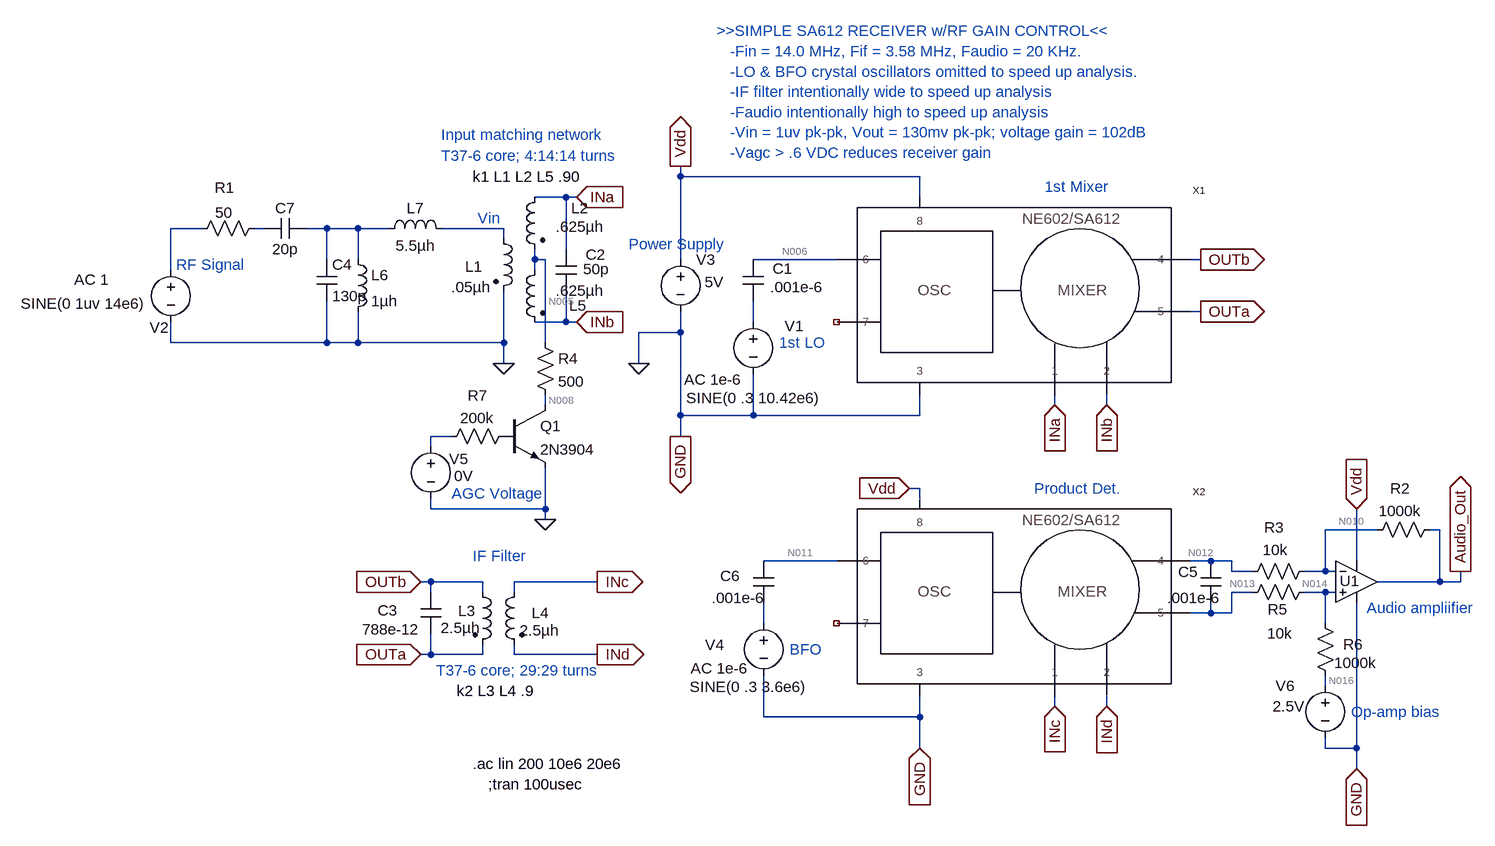
[diagram p0: schematic NE602 Rx.asc]
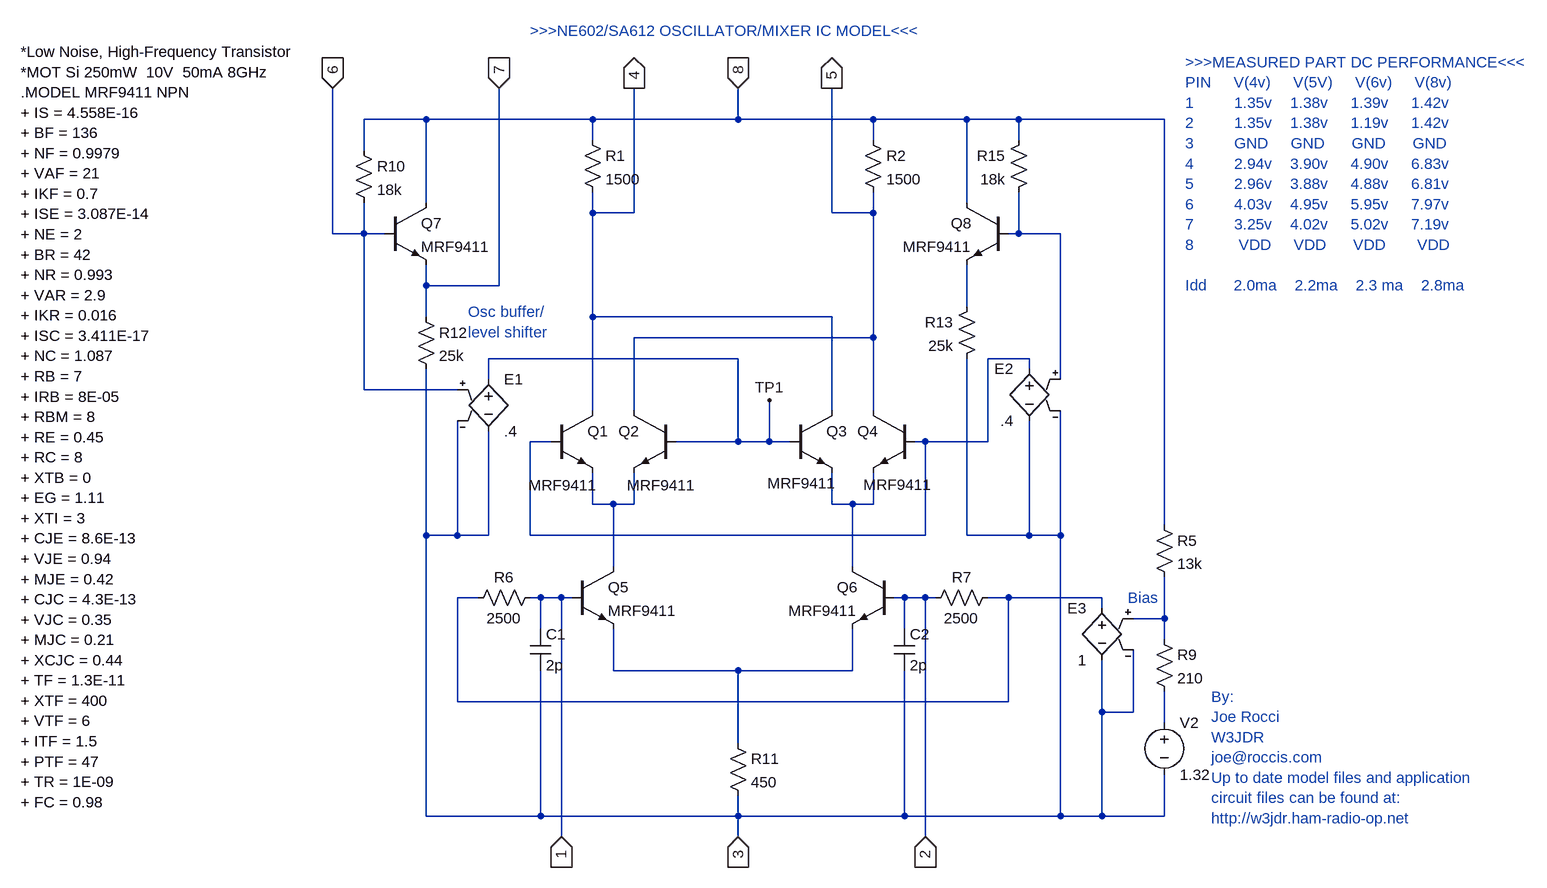
[diagram p1: sub-circuit sa612.asc]
NE602 Rx.asc, the LTspice schematic file:
Version 4
SHEET 1 2600 1360
WIRE -176 -352 -176 -368
WIRE 192 -352 -176 -352
WIRE -352 -320 -400 -320
WIRE -336 -320 -352 -320
WIRE 192 -320 192 -352
WIRE -912 -272 -960 -272
WIRE -816 -272 -832 -272
WIRE -720 -272 -752 -272
WIRE -672 -272 -720 -272
WIRE -624 -272 -672 -272
WIRE -448 -272 -544 -272
WIRE -448 -256 -448 -272
WIRE -352 -240 -352 -320
WIRE -720 -224 -720 -272
WIRE -672 -224 -672 -272
WIRE -400 -224 -400 -240
WIRE -384 -224 -400 -224
WIRE -176 -224 -176 -352
WIRE 64 -224 -64 -224
WIRE 624 -224 608 -224
WIRE -960 -208 -960 -272
WIRE -400 -208 -400 -224
WIRE 624 -144 608 -144
WIRE -352 -128 -352 -176
WIRE -352 -128 -400 -128
WIRE -336 -128 -352 -128
WIRE -64 -128 -64 -160
WIRE -176 -112 -176 -144
WIRE -176 -112 -240 -112
WIRE -960 -96 -960 -128
WIRE -720 -96 -720 -160
WIRE -720 -96 -960 -96
WIRE -672 -96 -672 -144
WIRE -672 -96 -720 -96
WIRE -448 -96 -448 -176
WIRE -448 -96 -672 -96
WIRE -384 -96 -384 -224
WIRE -448 -64 -448 -96
WIRE -240 -64 -240 -112
WIRE -384 0 -384 -16
WIRE 400 0 400 -16
WIRE 480 0 480 -16
WIRE -176 16 -176 -112
WIRE -64 16 -64 -48
WIRE -64 16 -176 16
WIRE 192 16 192 -16
WIRE 192 16 -64 16
WIRE -528 48 -560 48
WIRE -176 48 -176 16
WIRE -560 64 -560 48
WIRE 192 128 176 128
WIRE 192 144 192 128
WIRE -560 160 -560 144
WIRE -384 160 -384 96
WIRE -384 160 -560 160
WIRE -384 176 -384 160
WIRE 896 192 816 192
WIRE 992 192 976 192
WIRE 64 240 -48 240
WIRE 640 240 608 240
WIRE 672 240 640 240
WIRE 864 240 864 160
WIRE 672 256 672 240
WIRE 704 256 672 256
WIRE 816 256 816 192
WIRE 816 256 784 256
WIRE 832 256 816 256
WIRE -560 272 -576 272
WIRE -480 272 -560 272
WIRE -304 272 -432 272
WIRE 992 272 992 192
WIRE 992 272 896 272
WIRE 1024 272 1024 256
WIRE 1024 272 992 272
WIRE -560 288 -560 272
WIRE -480 288 -480 272
WIRE -432 288 -432 272
WIRE 704 288 672 288
WIRE 816 288 784 288
WIRE 832 288 816 288
WIRE 640 320 640 304
WIRE 640 320 608 320
WIRE 672 320 672 288
WIRE 672 320 640 320
WIRE -48 336 -48 304
WIRE 816 336 816 288
WIRE -560 384 -560 352
WIRE -560 384 -576 384
WIRE -480 384 -480 368
WIRE -480 384 -560 384
WIRE -432 384 -432 368
WIRE -304 384 -432 384
WIRE 816 432 816 416
WIRE 400 464 400 448
WIRE 480 464 480 448
WIRE -48 480 -48 416
WIRE 192 480 192 448
WIRE 192 480 -48 480
WIRE 192 528 192 480
WIRE 816 528 816 512
WIRE 864 528 864 304
WIRE 864 528 816 528
WIRE 864 560 864 528
FLAG -176 -368 Vdd
IOPIN -176 -368 Out
FLAG -176 48 GND
IOPIN -176 48 Out
FLAG -240 -64 0
FLAG -576 272 OUTb
IOPIN -576 272 In
FLAG -576 384 OUTa
IOPIN -576 384 In
FLAG 624 -224 OUTb
IOPIN 624 -224 Out
FLAG 624 -144 OUTa
IOPIN 624 -144 Out
FLAG 400 0 INa
IOPIN 400 0 In
FLAG 480 0 INb
IOPIN 480 0 In
FLAG -304 272 INc
IOPIN -304 272 Out
FLAG 176 128 Vdd
IOPIN 176 128 In
FLAG 192 528 GND
IOPIN 192 528 In
FLAG 400 464 INc
IOPIN 400 464 In
FLAG 480 464 INd
IOPIN 480 464 In
FLAG -304 384 INd
IOPIN -304 384 Out
FLAG 864 160 Vdd
IOPIN 864 160 In
FLAG 864 560 GND
IOPIN 864 560 In
FLAG 1024 256 Audio_Out
IOPIN 1024 256 Out
FLAG -384 176 0
FLAG -448 -64 0
FLAG -336 -320 INa
IOPIN -336 -320 In
FLAG -336 -128 INb
IOPIN -336 -128 In
SYMBOL voltage -176 -240 R0
WINDOW 123 0 0 Left 0
WINDOW 39 0 0 Left 0
WINDOW 3 37 51 Left 0
SYMATTR Value 5V
SYMATTR InstName V3
SYMBOL ind2 -496 272 R0
WINDOW 0 -22 45 Left 0
WINDOW 3 -49 71 Left 0
SYMATTR InstName L3
SYMATTR Value 2.5µh
SYMATTR Type ind
SYMBOL ind2 -416 272 M0
WINDOW 0 -38 48 Left 0
WINDOW 3 -53 75 Left 0
SYMATTR InstName L4
SYMATTR Value 2.5µh
SYMATTR Type ind
SYMBOL cap -576 288 R0
WINDOW 3 -90 57 Left 0
WINDOW 0 -66 28 Left 0
SYMATTR Value 788e-12
SYMATTR InstName C3
SYMBOL sa612 304 -176 R0
SYMATTR InstName X1
SYMBOL voltage -64 -144 R0
WINDOW 123 -106 105 Left 0
WINDOW 39 0 0 Left 0
WINDOW 0 48 22 Left 0
WINDOW 3 -103 133 Left 0
SYMATTR Value2 AC 1e-6
SYMATTR InstName V1
SYMATTR Value SINE(0 .3 10.42e6)
SYMBOL cap -80 -224 R0
WINDOW 0 46 14 Left 0
WINDOW 3 42 42 Left 0
SYMATTR InstName C1
SYMATTR Value .001e-6
SYMBOL sa612 304 288 R0
SYMATTR InstName X2
SYMBOL voltage -48 320 R0
WINDOW 123 -112 85 Left 0
WINDOW 39 0 0 Left 0
WINDOW 0 -90 49 Left 0
WINDOW 3 -114 114 Left 0
SYMATTR Value2 AC 1e-6
SYMATTR InstName V4
SYMATTR Value SINE(0 .3 3.6e6)
SYMBOL cap -64 240 R0
WINDOW 0 -51 23 Left 0
WINDOW 3 -64 57 Left 0
SYMATTR InstName C6
SYMATTR Value .001e-6
SYMBOL Opamps\\UniversalOpamp 864 272 R0
WINDOW 0 -26 -1 Left 0
SYMATTR InstName U1
SYMBOL res 992 176 R90
WINDOW 0 -32 61 VBottom 0
WINDOW 3 -29 61 VTop 0
SYMATTR InstName R2
SYMATTR Value 1000k
SYMBOL res 800 240 R90
WINDOW 0 -36 63 VBottom 0
WINDOW 3 -33 61 VTop 0
SYMATTR InstName R3
SYMATTR Value 10k
SYMBOL res 800 272 R90
WINDOW 0 58 57 VBottom 0
WINDOW 3 64 54 VTop 0
SYMATTR InstName R5
SYMATTR Value 10k
SYMBOL res 832 432 R180
WINDOW 0 -42 64 Left 0
WINDOW 3 -64 35 Left 0
SYMATTR InstName R6
SYMATTR Value 1000k
SYMBOL voltage 816 416 R0
WINDOW 0 -76 16 Left 0
WINDOW 123 0 0 Left 0
WINDOW 39 0 0 Left 0
WINDOW 3 -81 48 Left 0
SYMATTR InstName V6
SYMATTR Value 2.5V
SYMBOL cap 624 240 R0
WINDOW 0 -34 17 Left 0
WINDOW 3 -51 57 Left 0
SYMATTR InstName C5
SYMATTR Value .001e-6
SYMBOL voltage -960 -224 R0
WINDOW 123 -149 31 Left 0
WINDOW 39 0 0 Left 0
WINDOW 0 -33 105 Left 0
WINDOW 3 -231 68 Left 0
SYMATTR Value2 AC 1
SYMATTR InstName V2
SYMATTR Value SINE(0 1uv 14e6)
SYMBOL ind2 -464 -272 R0
WINDOW 0 -43 59 Left 0
WINDOW 3 -65 90 Left 0
SYMATTR InstName L1
SYMATTR Value .05µh
SYMATTR Type ind
SYMBOL ind2 -384 -336 M0
WINDOW 0 -67 33 Left 0
WINDOW 3 -90 61 Left 0
SYMATTR InstName L2
SYMATTR Value .625µh
SYMATTR Type ind
SYMBOL res -816 -288 R90
WINDOW 0 -31 61 VBottom 0
WINDOW 3 -24 62 VTop 0
SYMATTR InstName R1
SYMATTR Value 50
SYMBOL cap -368 -240 R0
WINDOW 3 42 31 Left 0
WINDOW 0 46 8 Left 0
SYMATTR Value 50p
SYMATTR InstName C2
SYMBOL ind2 -384 -224 M0
WINDOW 0 -64 71 Left 0
WINDOW 3 -90 48 Left 0
SYMATTR InstName L5
SYMATTR Value .625µh
SYMATTR Type ind
SYMBOL res -400 -112 R0
SYMATTR InstName R4
SYMATTR Value 500
SYMBOL voltage -560 48 R0
WINDOW 123 0 0 Left 0
WINDOW 39 0 0 Left 0
WINDOW 0 28 35 Left 0
WINDOW 3 36 61 Left 0
SYMATTR InstName V5
SYMATTR Value 0V
SYMBOL npn -448 0 R0
SYMATTR InstName Q1
SYMATTR Value 2N3904
SYMBOL res -432 32 R90
WINDOW 0 -31 56 VBottom 0
WINDOW 3 -28 57 VTop 0
SYMATTR InstName R7
SYMATTR Value 200k
SYMBOL ind -688 -240 R0
SYMATTR InstName L6
SYMATTR Value 1µh
SYMATTR SpiceLine Rser=.01
SYMBOL cap -736 -224 R0
SYMATTR InstName C4
SYMATTR Value 130p
SYMBOL cap -752 -288 R90
WINDOW 0 0 32 VBottom 0
WINDOW 3 32 32 VTop 0
SYMATTR InstName C7
SYMATTR Value 20p
SYMBOL ind -640 -256 R270
WINDOW 0 32 56 VTop 0
WINDOW 3 5 56 VBottom 0
SYMATTR InstName L7
SYMATTR Value 5.5µh
SYMATTR SpiceLine Rser=0
TEXT -472 584 Left 0 !;tran 100usec
TEXT -256 -248 Left 0 ;Power Supply
TEXT -520 440 Left 0 !k2 L3 L4 .9
TEXT 384 -336 Left 0 ;1st Mixer
TEXT 368 128 Left 0 ;Product Det.
TEXT -496 232 Left 0 ;IF Filter
TEXT -120 -576 Left 0 ;>>SIMPLE SA612 RECEIVER w/RF GAIN CONTROL<<\n   -Fin = 14.0 MHz, Fif = 3.58 MHz, Faudio = 20 KHz.\n   -LO & BFO crystal oscillators omitted to speed up analysis.\n   -IF filter intentionally wide to speed up analysis\n   -Faudio intentionally high to speed up analysis\n   -Vin = 1uv pk-pk, Vout = 130mv pk-pk; voltage gain = 102dB\n   -Vagc > .6 VDC reduces receiver gain
TEXT -8 376 Left 0 ;BFO
TEXT 880 312 Left 0 ;Audio ampliifier
TEXT 856 472 Left 0 ;Op-amp bias
TEXT -24 -96 Left 0 ;1st LO
TEXT -496 552 Left 0 !.ac lin 200 10e6 20e6
TEXT -552 408 Left 0 ;T37-6 core; 29:29 turns
TEXT -496 -352 Left 0 !k1 L1 L2 L5 .90
TEXT -544 -416 Left 0 ;Input matching network
TEXT -528 136 Left 0 ;AGC Voltage
TEXT -952 -216 Left 0 ;RF Signal
TEXT -488 -288 Left 0 ;Vin
TEXT -544 -384 Left 0 ;T37-6 core; 4:14:14 turns

sa612.asc, the sub-circuit schematic file:
Version 4
SHEET 1 2600 1660
WIRE -688 -560 -784 -560
WIRE -432 -560 -688 -560
WIRE -208 -560 -208 -608
WIRE -208 -560 -432 -560
WIRE 0 -560 -208 -560
WIRE 144 -560 0 -560
WIRE 224 -560 144 -560
WIRE 448 -560 224 -560
WIRE -432 -528 -432 -560
WIRE 0 -528 0 -560
WIRE 224 -528 224 -560
WIRE -784 -512 -784 -560
WIRE -688 -432 -688 -560
WIRE 144 -432 144 -560
WIRE -432 -416 -432 -448
WIRE -368 -416 -368 -608
WIRE -368 -416 -432 -416
WIRE -64 -416 -64 -608
WIRE 0 -416 0 -448
WIRE 0 -416 -64 -416
WIRE -832 -384 -832 -608
WIRE -784 -384 -784 -432
WIRE -784 -384 -832 -384
WIRE -752 -384 -784 -384
WIRE 224 -384 224 -448
WIRE 224 -384 208 -384
WIRE 288 -384 224 -384
WIRE -688 -304 -688 -336
WIRE -576 -304 -576 -608
WIRE -576 -304 -688 -304
WIRE 144 -272 144 -336
WIRE -688 -256 -688 -304
WIRE -432 -256 -432 -416
WIRE -64 -256 -432 -256
WIRE 0 -224 0 -416
WIRE 0 -224 -368 -224
WIRE -208 -192 -592 -192
WIRE 240 -192 176 -192
WIRE 240 -176 240 -192
WIRE -592 -160 -592 -192
WIRE 288 -160 288 -384
WIRE -784 -144 -784 -384
WIRE -640 -144 -784 -144
WIRE -432 -112 -432 -256
WIRE -368 -112 -368 -224
WIRE -64 -112 -64 -256
WIRE 0 -112 0 -224
WIRE -496 -64 -528 -64
WIRE -208 -64 -208 -192
WIRE -208 -64 -304 -64
WIRE -160 -64 -160 -128
WIRE -160 -64 -208 -64
WIRE -128 -64 -160 -64
WIRE 80 -64 64 -64
WIRE 176 -64 176 -192
WIRE 176 -64 80 -64
WIRE -432 32 -432 -16
WIRE -400 32 -432 32
WIRE -368 32 -368 -16
WIRE -368 32 -400 32
WIRE -64 32 -64 -16
WIRE -32 32 -64 32
WIRE 0 32 0 -16
WIRE 0 32 -32 32
WIRE 448 64 448 -560
WIRE -688 80 -688 -176
WIRE -640 80 -640 -96
WIRE -640 80 -688 80
WIRE -592 80 -592 -80
WIRE -592 80 -640 80
WIRE -528 80 -528 -64
WIRE 80 80 80 -64
WIRE 80 80 -528 80
WIRE 144 80 144 -192
WIRE 240 80 240 -96
WIRE 240 80 144 80
WIRE 288 80 288 -112
WIRE 288 80 240 80
WIRE -400 128 -400 32
WIRE -32 128 -32 32
WIRE -608 176 -640 176
WIRE -512 176 -528 176
WIRE -480 176 -512 176
WIRE -464 176 -480 176
WIRE 48 176 32 176
WIRE 80 176 48 176
WIRE 96 176 80 176
WIRE 208 176 176 176
WIRE 352 176 208 176
WIRE 352 192 352 176
WIRE 448 208 448 144
WIRE 448 208 400 208
WIRE -512 224 -512 176
WIRE 48 224 48 176
WIRE 448 240 448 208
WIRE -400 288 -400 224
WIRE -208 288 -400 288
WIRE -32 288 -32 224
WIRE -32 288 -208 288
WIRE -640 336 -640 176
WIRE 208 336 208 176
WIRE 208 336 -640 336
WIRE 352 352 352 272
WIRE 400 352 400 256
WIRE 400 352 352 352
WIRE 448 368 448 320
WIRE -208 400 -208 288
WIRE -688 512 -688 80
WIRE -512 512 -512 288
WIRE -512 512 -688 512
WIRE -208 512 -208 480
WIRE -208 512 -512 512
WIRE 48 512 48 288
WIRE 48 512 -208 512
WIRE 288 512 288 80
WIRE 288 512 48 512
WIRE 352 512 352 352
WIRE 352 512 288 512
WIRE 448 512 448 448
WIRE 448 512 352 512
WIRE -480 544 -480 176
WIRE -208 544 -208 512
WIRE 80 544 80 176
FLAG -64 -608 5
IOPIN -64 -608 Out
FLAG -368 -608 4
IOPIN -368 -608 Out
FLAG -208 -608 8
IOPIN -208 -608 In
FLAG -832 -608 6
IOPIN -832 -608 In
FLAG -576 -608 7
IOPIN -576 -608 In
FLAG 80 544 2
IOPIN 80 544 In
FLAG -480 544 1
IOPIN -480 544 In
FLAG -208 544 3
IOPIN -208 544 In
FLAG -160 -128 TP1
SYMBOL npn -464 128 R0
SYMATTR InstName Q5
SYMATTR Value MRF9411
SYMBOL res -448 -544 R0
SYMATTR InstName R1
SYMATTR Value 1500
SYMBOL res -16 -544 R0
SYMATTR InstName R2
SYMATTR Value 1500
SYMBOL res -512 160 R90
WINDOW 0 0 56 VBottom 0
WINDOW 3 32 56 VTop 0
SYMATTR InstName R6
SYMATTR Value 2500
SYMBOL res 192 160 R90
WINDOW 0 0 56 VBottom 0
WINDOW 3 32 56 VTop 0
SYMATTR InstName R7
SYMATTR Value 2500
SYMBOL res -224 384 R0
SYMATTR InstName R11
SYMATTR Value 450
SYMBOL res -704 -272 R0
SYMATTR InstName R12
SYMATTR Value 25k
SYMBOL res 432 224 R0
SYMATTR InstName R9
SYMATTR Value 210
SYMBOL voltage 448 352 R0
WINDOW 123 0 0 Left 0
WINDOW 39 0 0 Left 0
SYMATTR InstName V2
SYMATTR Value 1.32
SYMBOL res 432 48 R0
SYMATTR InstName R5
SYMATTR Value 13k
SYMBOL res -800 -528 R0
SYMATTR InstName R10
SYMATTR Value 18k
SYMBOL res 160 -288 M0
SYMATTR InstName R13
SYMATTR Value 25k
SYMBOL res 240 -544 M0
SYMATTR InstName R15
SYMATTR Value 18k
SYMBOL e -592 -176 R0
SYMATTR InstName E1
SYMATTR Value .4
SYMBOL e 240 -192 M0
SYMATTR InstName E2
SYMATTR Value .4
SYMBOL npn -496 -112 R0
WINDOW 3 117 115 Left 0
SYMATTR Value MRF9411
SYMATTR InstName Q1
SYMBOL npn -128 -112 R0
WINDOW 3 113 114 Left 0
SYMATTR Value MRF9411
SYMATTR InstName Q3
SYMBOL npn -752 -432 R0
SYMATTR InstName Q7
SYMATTR Value MRF9411
SYMBOL npn -304 -112 M0
WINDOW 3 120 115 Left 0
SYMATTR Value MRF9411
SYMATTR InstName Q2
SYMBOL npn 64 -112 M0
WINDOW 3 120 112 Left 0
SYMATTR Value MRF9411
SYMATTR InstName Q4
SYMBOL npn 32 128 M0
SYMATTR InstName Q6
SYMATTR Value MRF9411
SYMBOL npn 208 -432 M0
SYMATTR InstName Q8
SYMATTR Value MRF9411
SYMBOL e 352 176 M0
SYMATTR InstName E3
SYMATTR Value 1
SYMBOL cap -528 224 R0
SYMATTR InstName C1
SYMATTR Value 2p
SYMBOL cap 32 224 R0
SYMATTR InstName C2
SYMATTR Value 2p
TEXT 392 176 Left 0 ;Bias
TEXT -624 -264 Left 0 ;Osc buffer/\nlevel shifter
TEXT -1312 -664 Left 0 !*Low Noise, High-Frequency Transistor\n*MOT Si 250mW  10V  50mA 8GHz \n.MODEL MRF9411 NPN \n+ IS = 4.558E-16 \n+ BF = 136 \n+ NF = 0.9979 \n+ VAF = 21 \n+ IKF = 0.7 \n+ ISE = 3.087E-14 \n+ NE = 2 \n+ BR = 42 \n+ NR = 0.993 \n+ VAR = 2.9 \n+ IKR = 0.016 \n+ ISC = 3.411E-17 \n+ NC = 1.087 \n+ RB = 7 \n+ IRB = 8E-05 \n+ RBM = 8 \n+ RE = 0.45 \n+ RC = 8 \n+ XTB = 0 \n+ EG = 1.11 \n+ XTI = 3 \n+ CJE = 8.6E-13 \n+ VJE = 0.94 \n+ MJE = 0.42 \n+ CJC = 4.3E-13 \n+ VJC = 0.35 \n+ MJC = 0.21 \n+ XCJC = 0.44 \n+ TF = 1.3E-11 \n+ XTF = 400 \n+ VTF = 6 \n+ ITF = 1.5 \n+ PTF = 47 \n+ TR = 1E-09 \n+ FC = 0.98
TEXT 480 -648 Left 0 ;>>>MEASURED PART DC PERFORMANCE<<<\nPIN     V(4v)     V(5V)     V(6v)     V(8v)\n1         1.35v    1.38v     1.39v     1.42v\n2         1.35v    1.38v     1.19v     1.42v\n3         GND     GND      GND      GND\n4         2.94v    3.90v     4.90v     6.83v \n5         2.96v    3.88v     4.88v     6.81v\n6         4.03v    4.95v     5.95v     7.97v\n7         3.25v    4.02v     5.02v     7.19v\n8          VDD     VDD      VDD       VDD\n \nIdd      2.0ma    2.2ma    2.3 ma    2.8ma
TEXT 520 328 Left 0 ;By:\nJoe Rocci\nW3JDR\njoe@roccis.com\nUp to date model files and application\ncircuit files can be found at:\nhttp://w3jdr.ham-radio-op.net
TEXT -528 -696 Left 0 ;>>>NE602/SA612 OSCILLATOR/MIXER IC MODEL<<<

The netlist it stands for:
* NE602 Rx.asc
V3 Vdd 0 5V
L3 OUTb OUTa 2.5µh
L4 INc INd 2.5µh
C3 OUTb OUTa 788e-12
XX1 INa INb 0 OUTb OUTa N006 NC_01 Vdd sa612
V1 N007 0 SINE(0 .3 10.42e6) AC 1e-6
C1 N006 N007 .001e-6
XX2 INc INd 0 N012 N013 N011 NC_02 Vdd sa612
V4 N015 0 SINE(0 .3 3.6e6) AC 1e-6
C6 N011 N015 .001e-6
XU1 N014 N010 Vdd 0 Audio_Out level1 Avol=1Meg GBW=10Meg Vos=0 En=0 Enk=0 In=0 Ink=0 Rin=500Meg  ; pins In+ In- V+ V- OUT
R2 Audio_Out N010 1000k
R3 N010 N012 10k
R5 N014 N013 10k
R6 N016 N014 1000k
V6 N016 0 2.5V
C5 N012 N013 .001e-6
V2 N001 0 SINE(0 1uv 14e6) AC 1
L1 N004 0 .05µh
L2 INa N005 .625µh
R1 N002 N001 50
C2 INa INb 50p
L5 N005 INb .625µh
R4 N005 N008 500
V5 N009 0 0V
Q1 N008 P001 0 0 2N3904
R7 P001 N009 200k
L6 N003 0 1µh Rser=.01
C4 N003 0 130p
C7 N003 N002 20p
L7 N003 N004 5.5µh Rser=0

* block symbol definitions
.subckt sa612 1 2 3 4 5 6 7 8
Q5 N004 1 N008 0 MRF9411
R1 8 4 1500
R2 8 5 1500
R6 1 N006 2500
R7 N006 2 2500
R11 N008 3 450
R12 7 3 25k
R9 N007 N009 210
V2 N009 3 1.32
R5 8 N007 13k
R10 8 6 18k
R13 N002 3 25k
R15 8 N001 18k
E1 TP1 3 6 3 .4
E2 N003 3 N001 3 .4
Q1 4 N003 N004 0 MRF9411
Q3 4 TP1 N005 0 MRF9411
Q7 8 6 7 0 MRF9411
Q2 5 TP1 N004 0 MRF9411
Q4 5 N003 N005 0 MRF9411
Q6 N005 2 N008 0 MRF9411
Q8 8 N001 N002 0 MRF9411
E3 N006 3 N007 3 1
C1 1 3 2p
C2 2 3 2p
* Bias
* Osc buffer/
* level shifter
*Low Noise, High-Frequency Transistor
*MOT Si 250mW  10V  50mA 8GHz
.MODEL MRF9411 NPN
+ IS = 4.558E-16
+ BF = 136
+ NF = 0.9979
+ VAF = 21
+ IKF = 0.7
+ ISE = 3.087E-14
+ NE = 2
+ BR = 42
+ NR = 0.993
+ VAR = 2.9
+ IKR = 0.016
+ ISC = 3.411E-17
+ NC = 1.087
+ RB = 7
+ IRB = 8E-05
+ RBM = 8
+ RE = 0.45
+ RC = 8
+ XTB = 0
+ EG = 1.11
+ XTI = 3
+ CJE = 8.6E-13
+ VJE = 0.94
+ MJE = 0.42
+ CJC = 4.3E-13
+ VJC = 0.35
+ MJC = 0.21
+ XCJC = 0.44
+ TF = 1.3E-11
+ XTF = 400
+ VTF = 6
+ ITF = 1.5
+ PTF = 47
+ TR = 1E-09
+ FC = 0.98
* >>>MEASURED PART DC PERFORMANCE<<<
* PIN     V(4v)     V(5V)     V(6v)     V(8v)
* 1         1.35v    1.38v     1.39v     1.42v
* 2         1.35v    1.38v     1.19v     1.42v
* 3         GND     GND      GND      GND
* 4         2.94v    3.90v     4.90v     6.83v
* 5         2.96v    3.88v     4.88v     6.81v
* 6         4.03v    4.95v     5.95v     7.97v
* 7         3.25v    4.02v     5.02v     7.19v
* 8          VDD     VDD      VDD       VDD
* Idd      2.0ma    2.2ma    2.3 ma    2.8ma
* By:
* Joe Rocci
* W3JDR
* joe@roccis.com
* Up to date model files and application
* circuit files can be found at:
* http://w3jdr.ham-radio-op.net
* >>>NE602/SA612 OSCILLATOR/MIXER IC MODEL<<<
.ends sa612

.model NPN NPN
.model PNP PNP
.lib standard.bjt
;tran 100usec
* Power Supply
k2 L3 L4 .9
* 1st Mixer
* Product Det.
* IF Filter
* >>SIMPLE SA612 RECEIVER w/RF GAIN CONTROL<<
*    -Fin = 14.0 MHz, Fif = 3.58 MHz, Faudio = 20 KHz.
*    -LO & BFO crystal oscillators omitted to speed up analysis.
*    -IF filter intentionally wide to speed up analysis
*    -Faudio intentionally high to speed up analysis
*    -Vin = 1uv pk-pk, Vout = 130mv pk-pk; voltage gain = 102dB
*    -Vagc > .6 VDC reduces receiver gain
* BFO
* Audio ampliifier
* Op-amp bias
* 1st LO
.ac lin 200 10e6 20e6
* T37-6 core; 29:29 turns
k1 L1 L2 L5 .90
* Input matching network
* AGC Voltage
* RF Signal
* Vin
* T37-6 core; 4:14:14 turns
.lib UniversalOpAmp1.lib
.backanno
.end

* Results of the author's LTspice run, read from the files saved beside the schematic
* Operating Point, zero values left out:
*   V(vdd) = 5 V
*   V(outb) = 3.971 V
*   V(outa) = 3.971 V
*   V(inc) = 1.361 V
*   V(ind) = 1.361 V
*   V(ina) = 1.361 V
*   V(inb) = 1.361 V
*   V(n006) = 4.97 V
*   V(n012) = 3.968 V
*   V(n013) = 3.968 V
*   V(n011) = 4.97 V
*   V(audio_out) = 2.5 V
*   V(n010) = 3.954 V
*   V(n014) = 3.954 V
*   V(n016) = 2.5 V
*   V(n005) = 1.361 V
*   V(n008) = 1.361 V
*   V(p001) = 272.8 nV
*   Ic(Q1) = 1.374 pA
*   Ib(Q1) = -1.364 pA
*   I(R7) = 1.364 pA
*   I(R4) = 1.375 pA
*   I(R6) = -1.454 µA
*   I(R5) = -1.457 µA
*   I(R3) = -1.457 µA
*   I(R2) = -1.454 µA
*   I(V5) = 1.364 pA
*   I(V6) = 1.454 µA
*   I(V3) = -4.238 mA
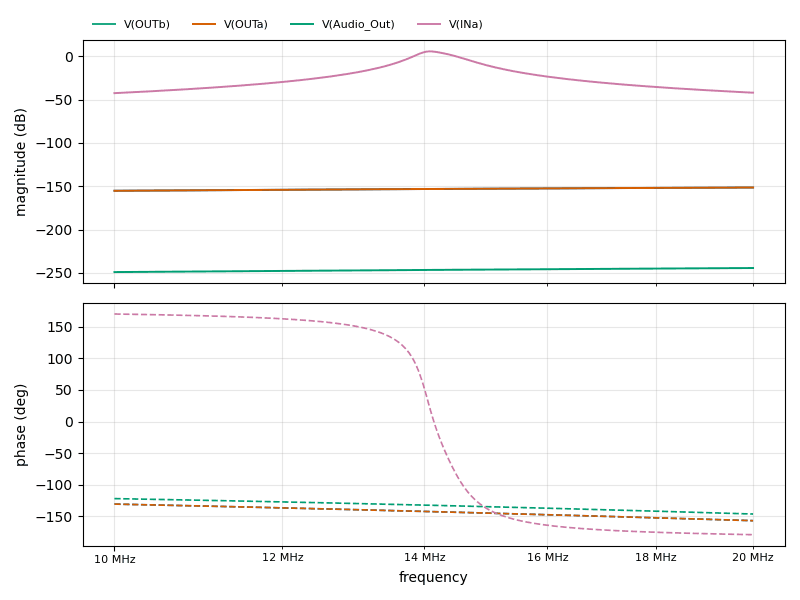
[diagram p2: AC Analysis of NE602 Rx.asc, plotted from the saved traces]
* AC Analysis, 1 run:
*   V(OUTb): -155.16 dB at 10 MHz, -151.38 dB at 20 MHz, peak -151.38 dB at 20 MHz, 3 dB below the peak at 11.26 MHz
*   V(OUTa): -155.16 dB at 10 MHz, -151.38 dB at 20 MHz, peak -151.38 dB at 20 MHz, 3 dB below the peak at 11.26 MHz
*   V(Audio_Out): -248.94 dB at 10 MHz, -244.28 dB at 20 MHz, peak -244.28 dB at 20 MHz, 3 dB below the peak at 12.52 MHz
*   V(INa): -42.52 dB at 10 MHz, -42.00 dB at 20 MHz, peak 5.66 dB at 14.07 MHz, 3 dB below the peak at 13.92 MHz and 14.34 MHz